# Altium schematic sheet IMU_Sch.SchDoc
size A3
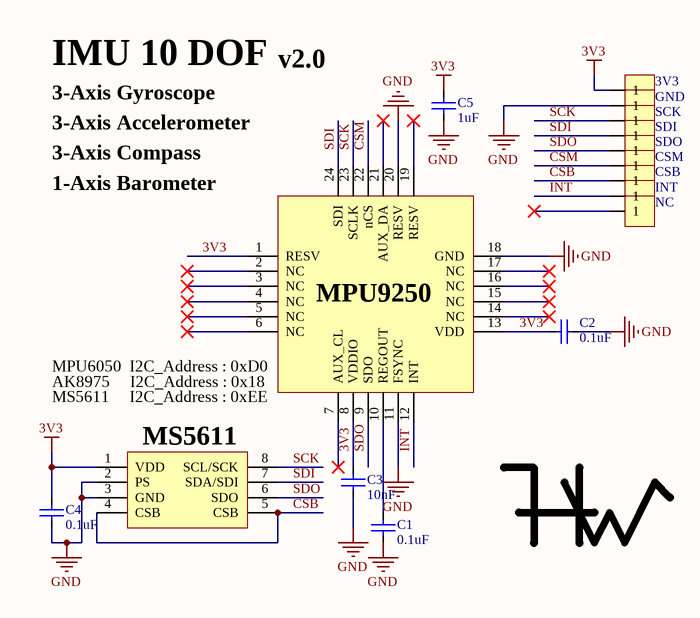
[diagram p0: IMU_Sch.SchDoc]

## Parts
3V3  Pad1X1_1.27  [Pad1X1_1.27]  (value not drawn)
C1  value 0.1uF  [CAP_0603]  (hidden comment: Cap_0603)
C2  value 0.1uF  [CAP_0603]  (hidden comment: Cap_0603)
C3  value 10nF  [CAP_0603]  (hidden comment: Cap_0603)
C4  value 0.1uF  [CAP_0603]  (hidden comment: Cap_0603)
C5  value 1uF  [CAP_0603]  (hidden comment: Cap_0603)
CSB  Pad1X1_1.27  [Pad1X1_1.27]  (value not drawn)
CSM  Pad1X1_1.27  [Pad1X1_1.27]  (value not drawn)
GND  Pad1X1_1.27  [Pad1X1_1.27]  (value not drawn)
INT  Pad1X1_1.27  [Pad1X1_1.27]  (value not drawn)
Mark  Mark  [Logo_HW]  (value not drawn)
MPU  MPU9250  [MPU9250]
MS  MS5611  [MS5611]
NC  Pad1X1_1.27  [Pad1X1_1.27]  (value not drawn)
SCK  Pad1X1_1.27  [Pad1X1_1.27]  (value not drawn)
SDI  Pad1X1_1.27  [Pad1X1_1.27]  (value not drawn)
SDO  Pad1X1_1.27  [Pad1X1_1.27]  (value not drawn)

## Nets
3V3: 3V3.1 C2.1 C3.2 C4.1 C5.2 MPU.1(RESV) MPU.8(VDDIO) MPU.13(VDD) MS.1(VDD)
GND: C1.2 C2.2 C3.1 C4.2 C5.1 GND.1 MPU.11(FSYNC) MPU.18(GND) MPU.20(RESV) MS.2(PS) MS.3(GND)
CSB: CSB.1 MS.4(CSB) MS.5(CSB)
CSM: CSM.1 MPU.22(nCS)
INT: INT.1 MPU.12(INT)
SCK: MPU.23(SCLK) MS.8(SCL/SCK) SCK.1
SDI: MPU.24(SDI) MS.7(SDA/SDI) SDI.1
SDO: MPU.9(SDO) MS.6(SDO) SDO.1
NetC1_1: C1.1 MPU.10(REGOUT)

Not connected (* = marked no-connect by the designer): MPU 2(NC)* 3(NC)* 4(NC)* 5(NC)* 6(NC)* 7(AUX_CL)* 14(NC)* 15(NC)* 16(NC)* 17(NC)* 19(RESV)* 21(AUX_DA)*; NC 1*

## Notes on the sheet
- IMU 10 DOF
- 3-Axis Gyroscope
- v2.0
- 3-Axis Accelerometer
- 3-Axis Compass
- (near MPU) 1-Axis Barometer
- (near MPU) AK8975     I2C_Address : 0x18
- (near MPU) MPU6050  I2C_Address : 0xD0
- (near MPU) MS5611     I2C_Address : 0xEE

## Library data of the parts
3V3 CSB CSM GND INT NC SCK SDI SDO = Pad1X1_1.27: Header
C1-C5 = Cap_0603: Capacitor
Mark = HW
MPU = MPU9250: Sensor
MS = MS5611: Sensor